# EAGLE design 1 byte output (EAGLE 9.4.2)
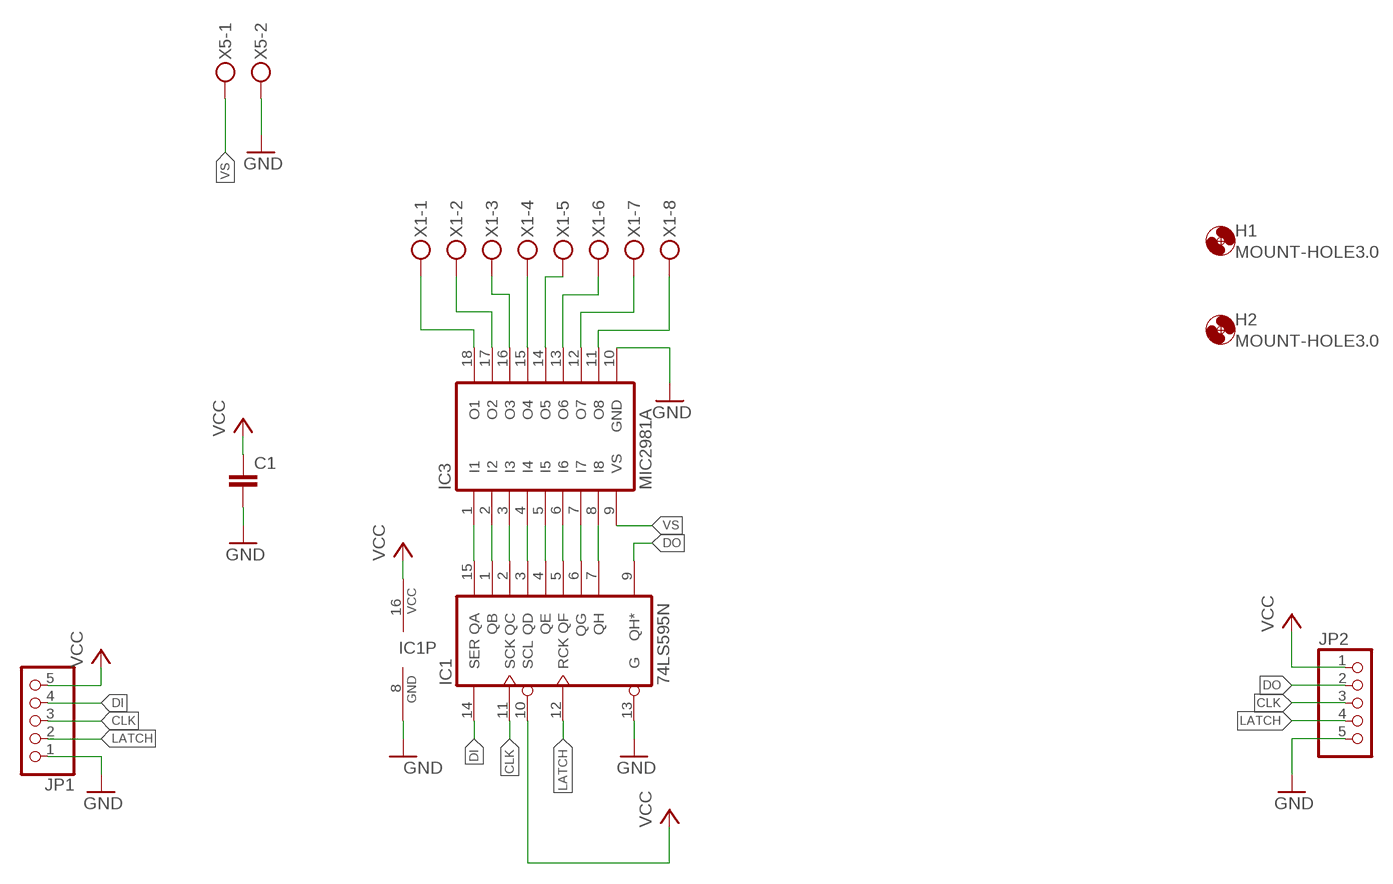
[diagram p0: schematic, sheet 1]

## Parts
C1  C-EU050-035X075  [C050-035X075]
H1  MOUNT-HOLE3.0  [3,0]
H2  MOUNT-HOLE3.0  [3,0]
IC1  74LS595N  [DIL16]
IC3  MIC2981A  UDN2981A  [DIL18]
JP1  PINHD-1X5/90  [1X05/90]
JP2  PINHD-1X5/90  [1X05/90]
X1  MKDSN1,5/8-5,08  [MKDSN1,5/8-5,08]
X5  MKDSN1,5/2-5,08  [MKDSN1,5/2-5,08]

## Nets
CLK: IC1.11(SCK) JP1.3 JP2.3
DI: IC1.14(SER) JP1.4
DO: IC1.9(QH*) JP2.2
GND: C1.2 IC1.8(GND) IC1.13(G) IC3.10(GND) JP1.1 JP2.5 X5.2
LATCH: IC1.12(RCK) JP1.2 JP2.4
N$1: IC3.15(O4) X1.4
N$2: IC3.16(O3) X1.3
N$3: IC3.17(O2) X1.2
N$4: IC3.18(O1) X1.1
N$5: IC3.14(O5) X1.5
N$6: IC3.12(O7) X1.7
N$7: IC3.11(O8) X1.8
N$8: IC3.13(O6) X1.6
N$17: IC1.15(QA) IC3.1(I1)
N$18: IC1.1(QB) IC3.2(I2)
N$19: IC1.2(QC) IC3.3(I3)
N$20: IC1.3(QD) IC3.4(I4)
N$21: IC1.4(QE) IC3.5(I5)
N$22: IC1.5(QF) IC3.6(I6)
N$23: IC1.6(QG) IC3.7(I7)
N$24: IC1.7(QH) IC3.8(I8)
VCC: C1.1 IC1.10(SCL) IC1.16(VCC) JP1.5 JP2.1
VS: IC3.9(VS) X5.1

## Library data of the parts
C1 = resistor:C-EU: CAPACITOR, European symbol
H1 H2 = holes:MOUNT-HOLE: MOUNTING HOLE with drill center marker
IC1 = 74xx-us:74*595: 8-bit SHIFT REGISTER, output latch
IC3 = uln-udn:UDN298*: DRIVER ARRAY Source: Allegro Microsystems Inc. / UDN2981-UDN2984.pdf
JP1 JP2 = pinhead:PINHD-1X5: PIN HEADER
X1 = con-phoenix-508:MKDSN1,5/8-5,08: MKDSN 1,5/ 8-5,08 Printklemme Nennstrom: 13,5 A Nennspannung: 250 V Rastermaß: 5,08 mm Polzahl: 8 Anschlussart: Schraubanschluss Montage: Löten Anschlussrichtung Leiter/Platine: 0 ° Artikelnummer: 1729186 Source: http://eshop.phoenixcontact.com .. 1729186.pdf
X5 = con-phoenix-508:MKDSN1,5/2-5,08: MKDSN 1,5/ 2-5,08 Printklemme Nennstrom: 13,5 A Nennspannung: 250 V Rastermaß: 5,08 mm Polzahl: 2 Anschlussart: Schraubanschluss Montage: Löten Anschlussrichtung Leiter/Platine: 0 ° Artikelnummer: 1729128 Source: http://eshop.phoenixcontact.com .. 1729128.pdf

## Board
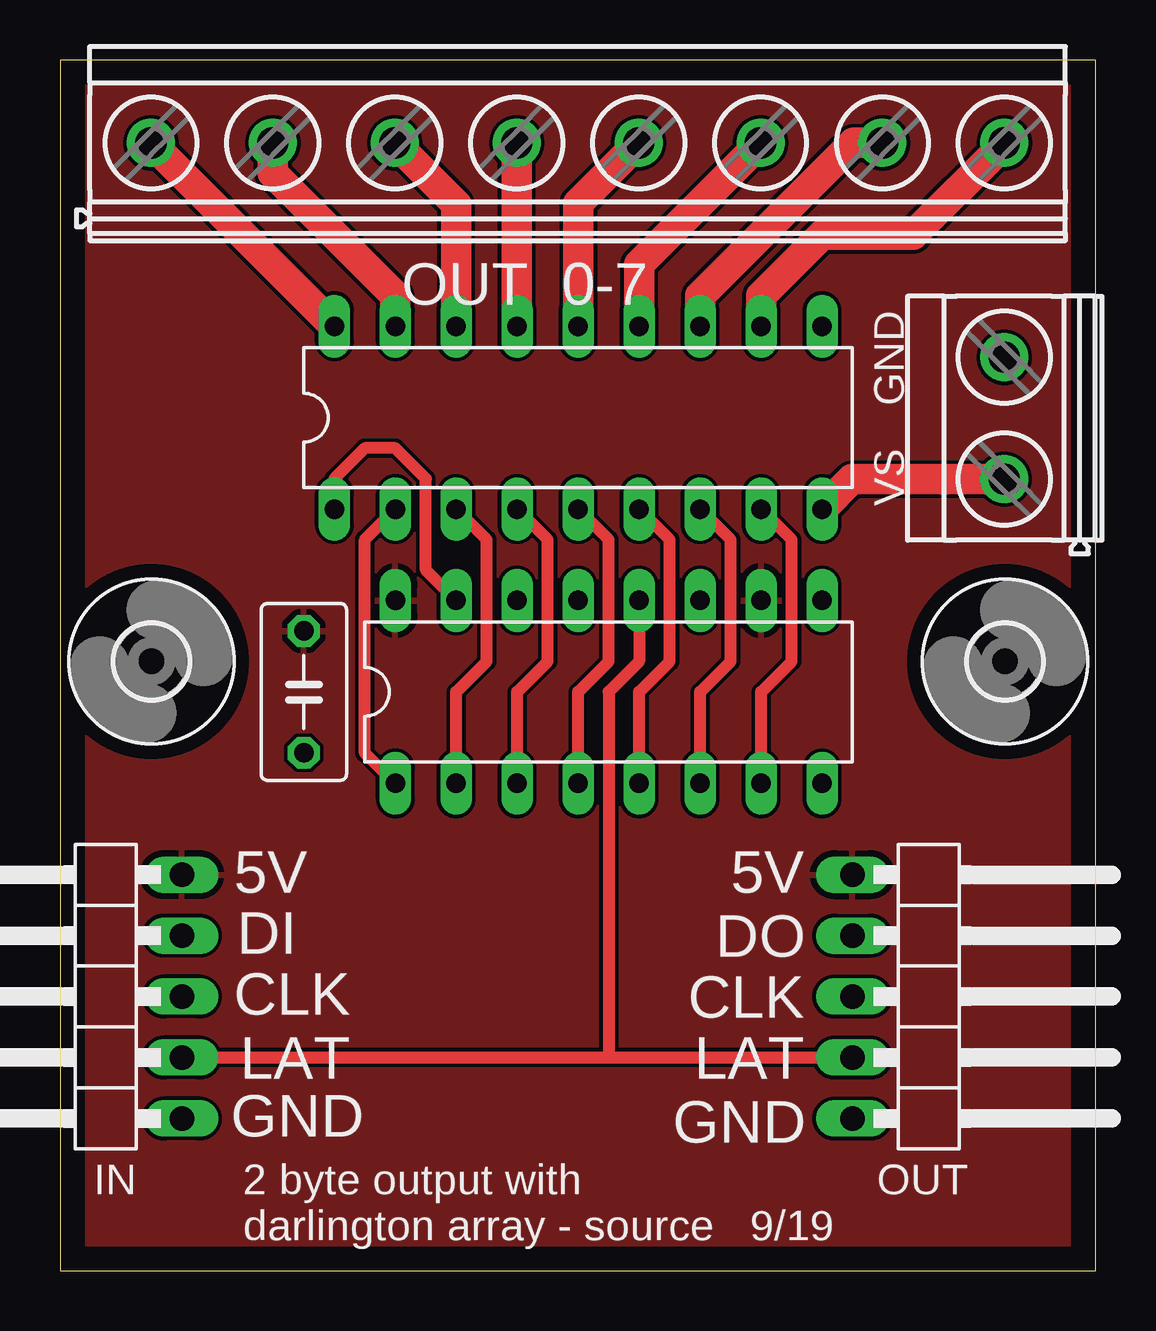
[diagram p1: board, top side]
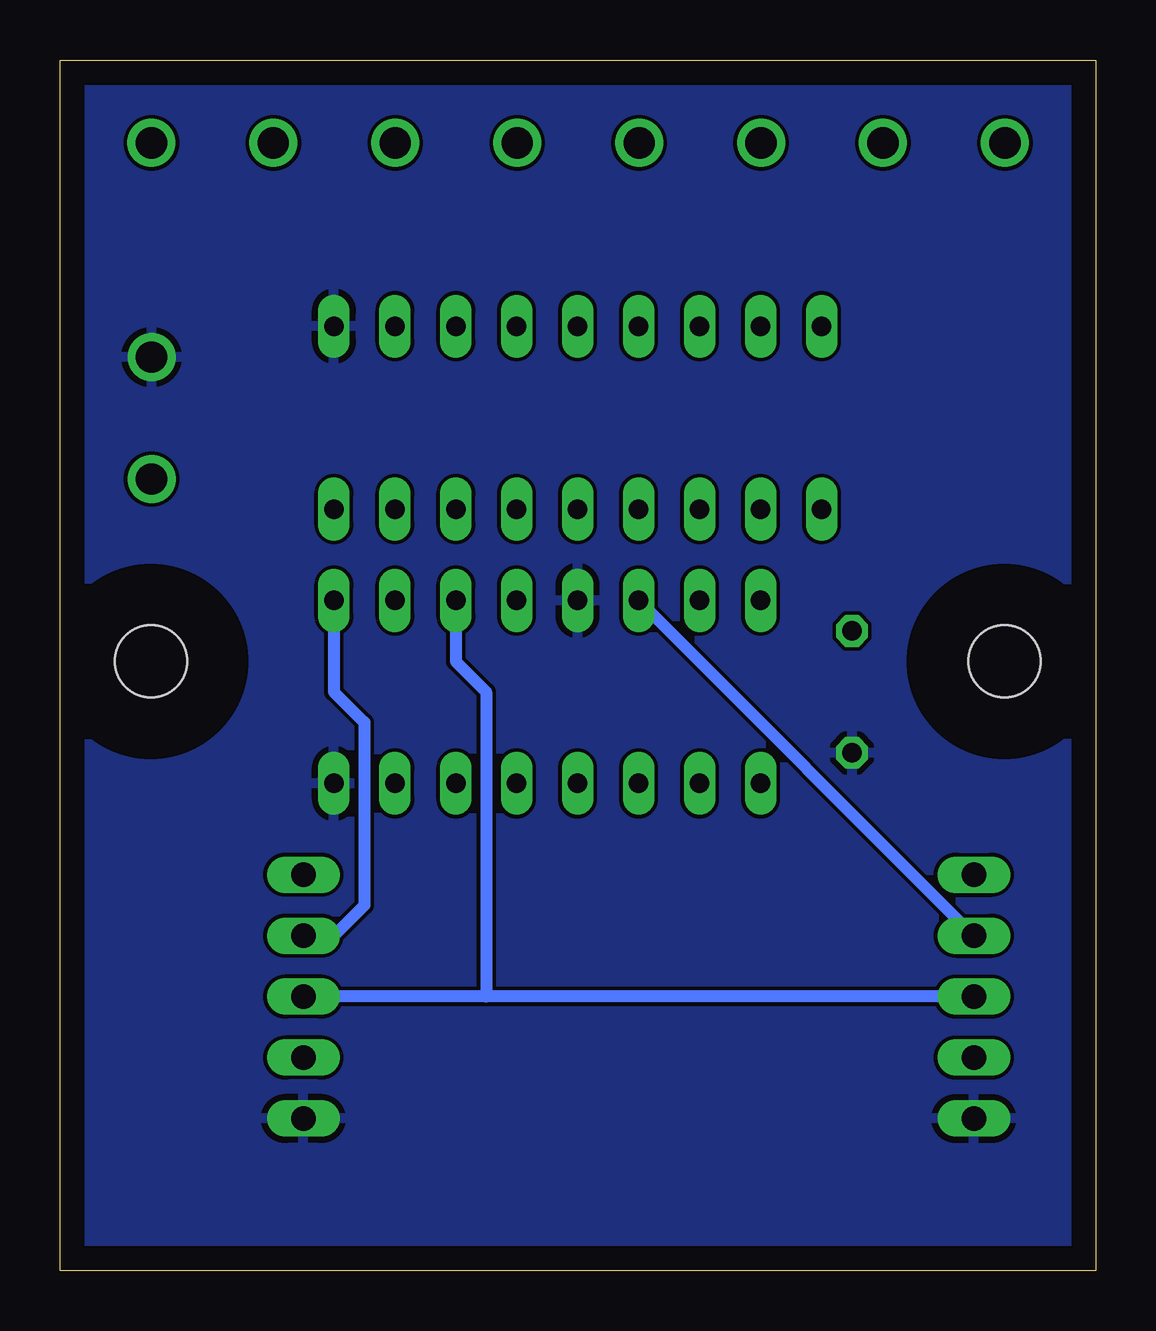
[diagram p2: board, bottom side, seen from below]

Size 43.16 x 50.47 mm. Coordinates in mm from the lower left corner, seen from the top.
Outline: 0,0 43.16,0 43.16,50.47 0,50.47 0,0
Copper layers (1*16): Top 0.035mm / dielectric 1.5mm / Bottom 0.035mm
Design rules "default": minimum track width 6mil, minimum drill 0.35mm, track to track 6mil, track to pad 6mil, pad to pad 6mil, via to via 6mil, smd to smd 6mil, copper to edge 40mil, drill to drill 6mil, minimum pad ring 10mil, minimum via ring 8mil, stop-mask expansion 4mil, vias tented up to drill 0mil, thermal gap 10mil

### Footprints (pad centres in the part's own frame; a part is rotated, then mirrored left to right if it is on the bottom)
C050-035X075 = drill 0.813 octagon: 1 -2.54,0; 2 2.54,0
3,0 = hole 3: 0,0
DIL16 = drill 0.813 long: 1 -8.89,-3.81; 2 -6.35,-3.81; 3 -3.81,-3.81; 4 -1.27,-3.81; 5 1.27,-3.81; 6 3.81,-3.81; 7 6.35,-3.81; 8 8.89,-3.81; 9 8.89,3.81; 10 6.35,3.81; 11 3.81,3.81; 12 1.27,3.81; 13 -1.27,3.81; 14 -3.81,3.81; 15 -6.35,3.81; 16 -8.89,3.81
DIL18 = drill 0.813 long: 1 -10.16,-3.81; 2 -7.62,-3.81; 3 -5.08,-3.81; 4 -2.54,-3.81; 5 0,-3.81; 6 2.54,-3.81; 7 5.08,-3.81; 8 7.62,-3.81; 9 10.16,-3.81; 10 10.16,3.81; 11 7.62,3.81; 12 5.08,3.81; 13 2.54,3.81; 14 0,3.81; 15 -2.54,3.81; 16 -5.08,3.81; 17 -7.62,3.81; 18 -10.16,3.81
1X05/90 = drill 1.016 long: 1 -5.08,-3.81; 2 -2.54,-3.81; 3 0,-3.81; 4 2.54,-3.81; 5 5.08,-3.81
MKDSN1,5/8-5,08 = drill 1.3 pad 2: 1 -17.801,0.025; 2 -12.721,0.025; 3 -7.641,0.025; 4 -2.561,0.025; 5 2.519,0.025; 6 7.599,0.025; 7 12.679,0.025; 8 17.759,0.025
MKDSN1,5/2-5,08 = drill 1.3 pad 2: 1 -2.561,0.025; 2 2.519,0.025

### Placement (x,y rotation side)
C1  10.16,24.13 270 top
H1  3.81,25.4 0 top
H2  39.37,25.4 0 top
IC1  22.86,24.13 0 top
IC3  21.59,35.56 0 top
JP1  1.27,11.43 90 top
JP2  36.83,11.43 270 top
X1  21.59,46.99 0 top
X5  39.37,35.56 90 top

### Tracks (layer width: path | path; a pad name or v marks a point on that pad's centre or on a via)
CLK
  Bottom 0.508: JP1.3 25.4,11.43 | 25.4,11.43 JP2.3 | IC1.11 26.67,25.4 25.4,24.13 25.4,11.43
DI
  Bottom 0.508: JP1.4 IC1.14
DO
  Bottom 0.508: IC1.9 31.75,24.13 30.48,22.86 30.48,15.24 31.75,13.97 JP2.2
GND
  pour Bottom: -3.81,54.61 85.09,54.61 85.09,-2.54 -3.81,-2.54
LATCH
  Top 0.508: JP1.2 22.86,8.89 | 22.86,8.89 JP2.4 | IC1.12 24.13,25.4 22.86,24.13 22.86,8.89
N$1
  Top 1.27: IC3.15 19.03,39.39 X1.4
N$2
  Top 1.27: X1.3 16.51,44.45 IC3.16
N$3
  Top 1.27: IC3.17 13.97,40.64 8.87,45.74 X1.2
N$4
  Top 1.27: X1.1 IC3.18
N$5
  Top 1.27: X1.5 21.59,44.5 IC3.14
N$6
  Top 1.27: IC3.12 26.67,40.64 33.05,47.02 X1.7
N$7
  Top 1.27: IC3.11 29.21,40.64 31.75,43.18 35.56,43.18 39.35,46.97 X1.8
N$8
  Top 1.27: IC3.13 24.13,41.96 X1.6
N$17
  Top 0.508: IC1.15 15.24,29.21 15.24,33.02 13.97,34.29 12.7,34.29 11.43,33.02 IC3.1
N$18
  Top 0.508: IC1.1 12.7,21.59 12.7,30.48 IC3.2
N$19
  Top 0.508: IC1.2 16.51,24.13 17.78,25.4 17.78,30.48 IC3.3
N$20
  Top 0.508: IC1.3 19.05,24.13 20.32,25.4 20.32,30.48 IC3.4
N$21
  Top 0.508: IC1.4 21.59,24.13 22.86,25.4 22.86,30.48 IC3.5
N$22
  Top 0.508: IC1.5 24.13,24.13 25.4,25.4 25.4,30.48 IC3.6
N$23
  Top 0.508: IC1.6 26.67,24.13 27.94,25.4 27.94,30.48 IC3.7
N$24
  Top 0.508: IC1.7 29.21,24.13 30.48,25.4 30.48,30.48 IC3.8
VCC
  pour Top: -2.54,-3.81 -2.54,58.42 87.63,58.42 87.63,-3.81
VS
  Top 1.27: IC3.9 33,33 X5.1

### Text on the board
tNames: OUT 0-7 | GND | VS | 5V | 5V | DI | DO | CLK | CLK | LAT | LAT | GND | GND | IN | OUT | 2 byte output with / darlington array - source 9/19